# EAGLE schematic 519_jetson_nano_2GB020000 (EAGLE 9.6.2)

## Sheet 1 of 2
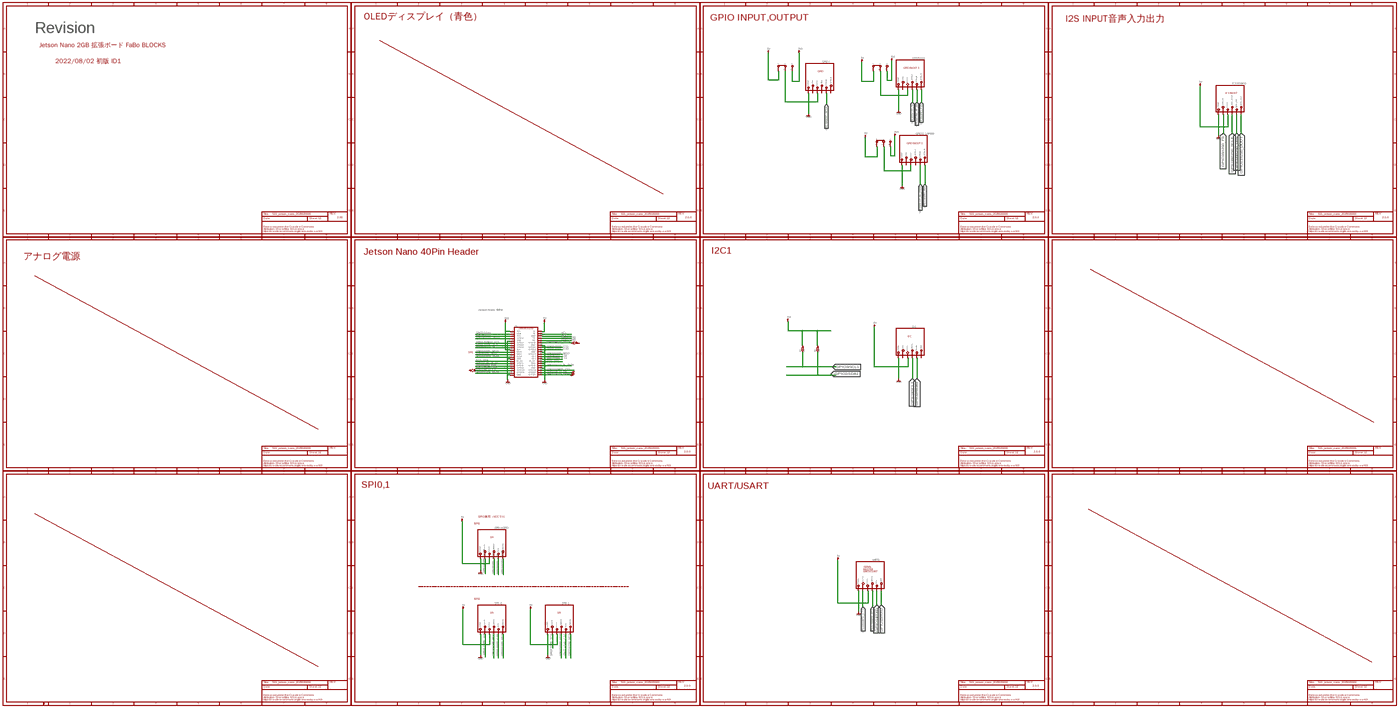
[diagram p0: schematic, sheet 1, overview]
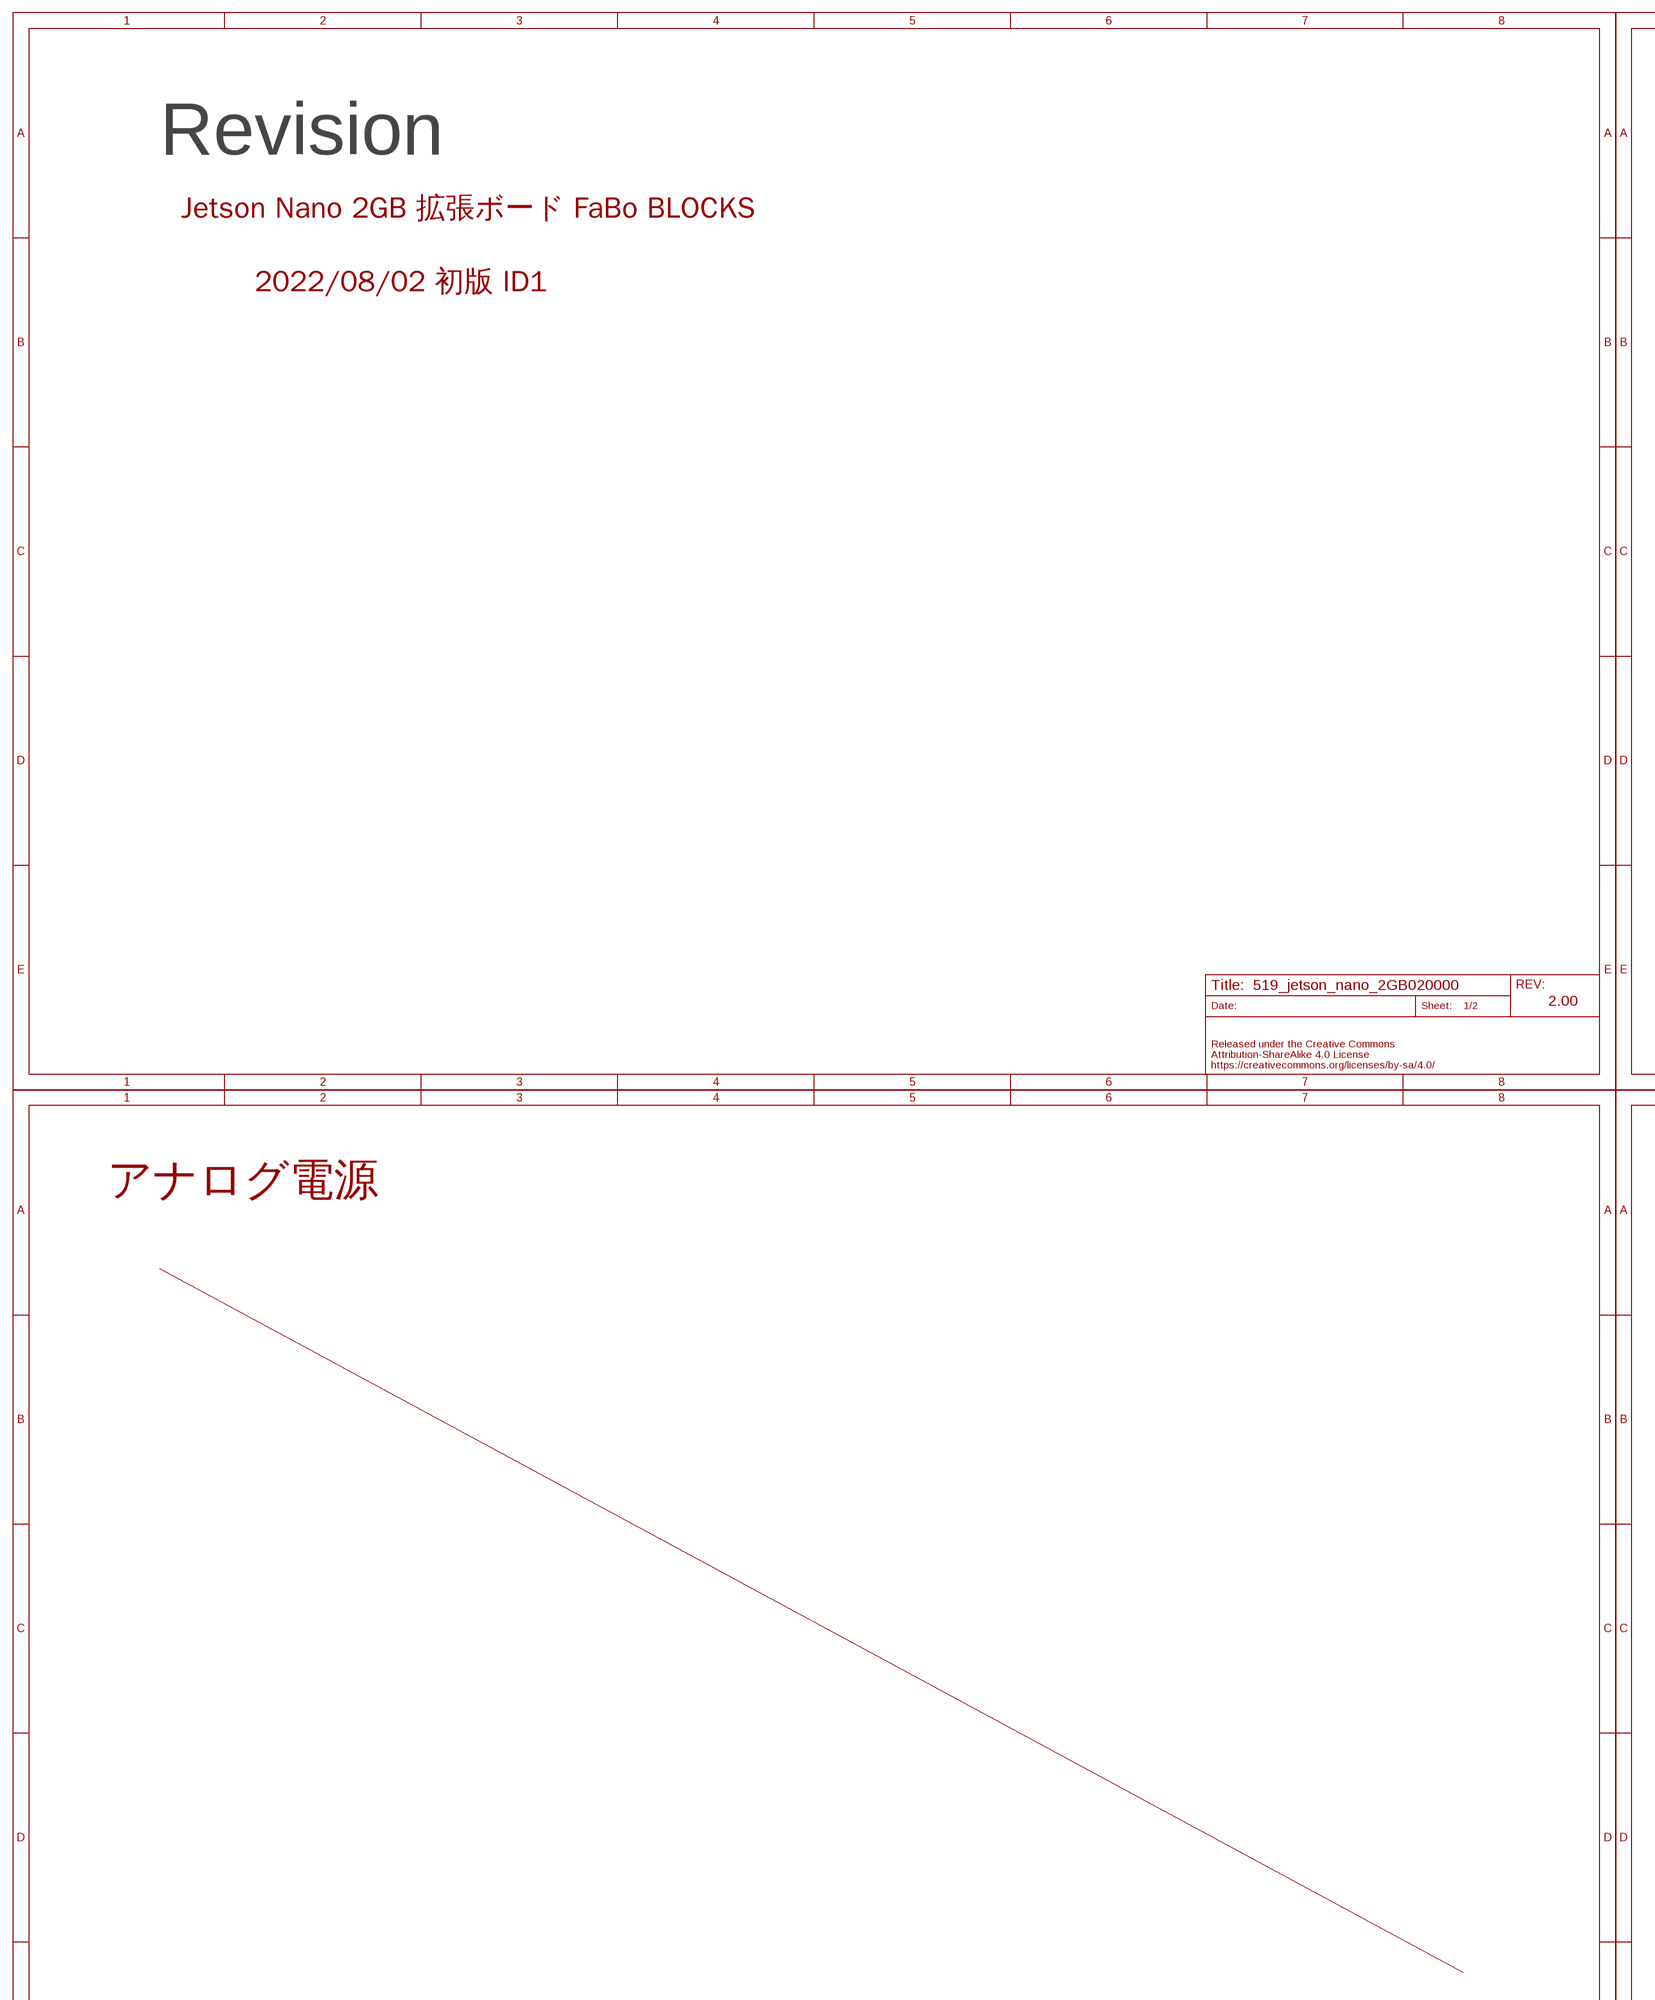
[diagram p1: schematic, sheet 1, part 1 of 6]
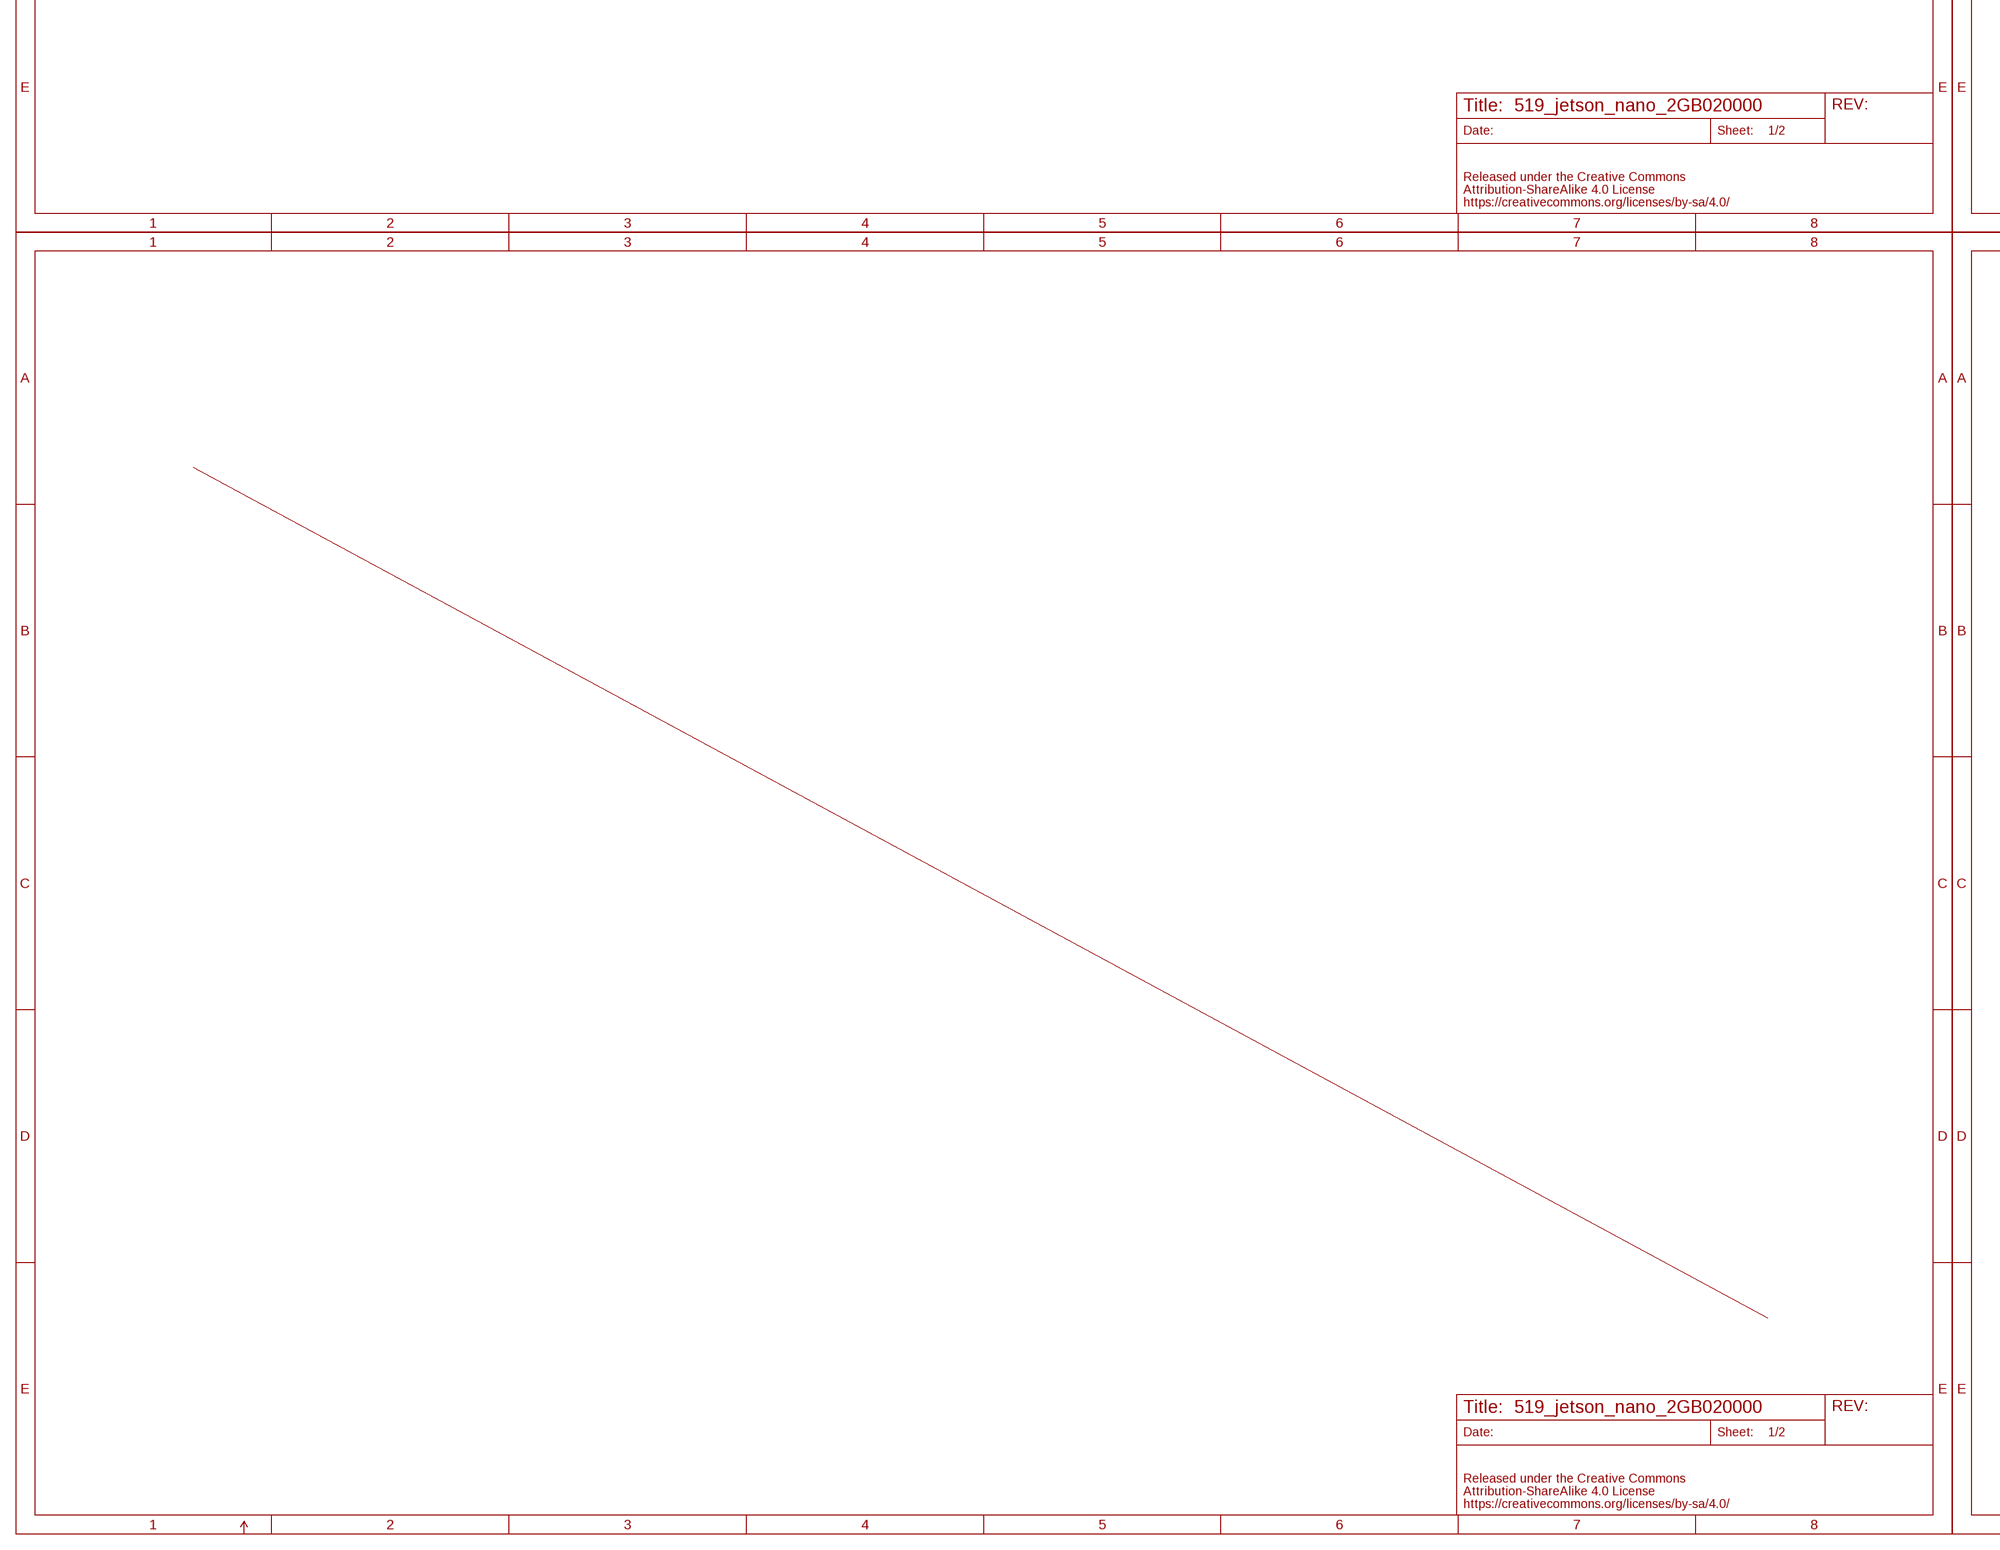
[diagram p2: schematic, sheet 1, part 2 of 6]
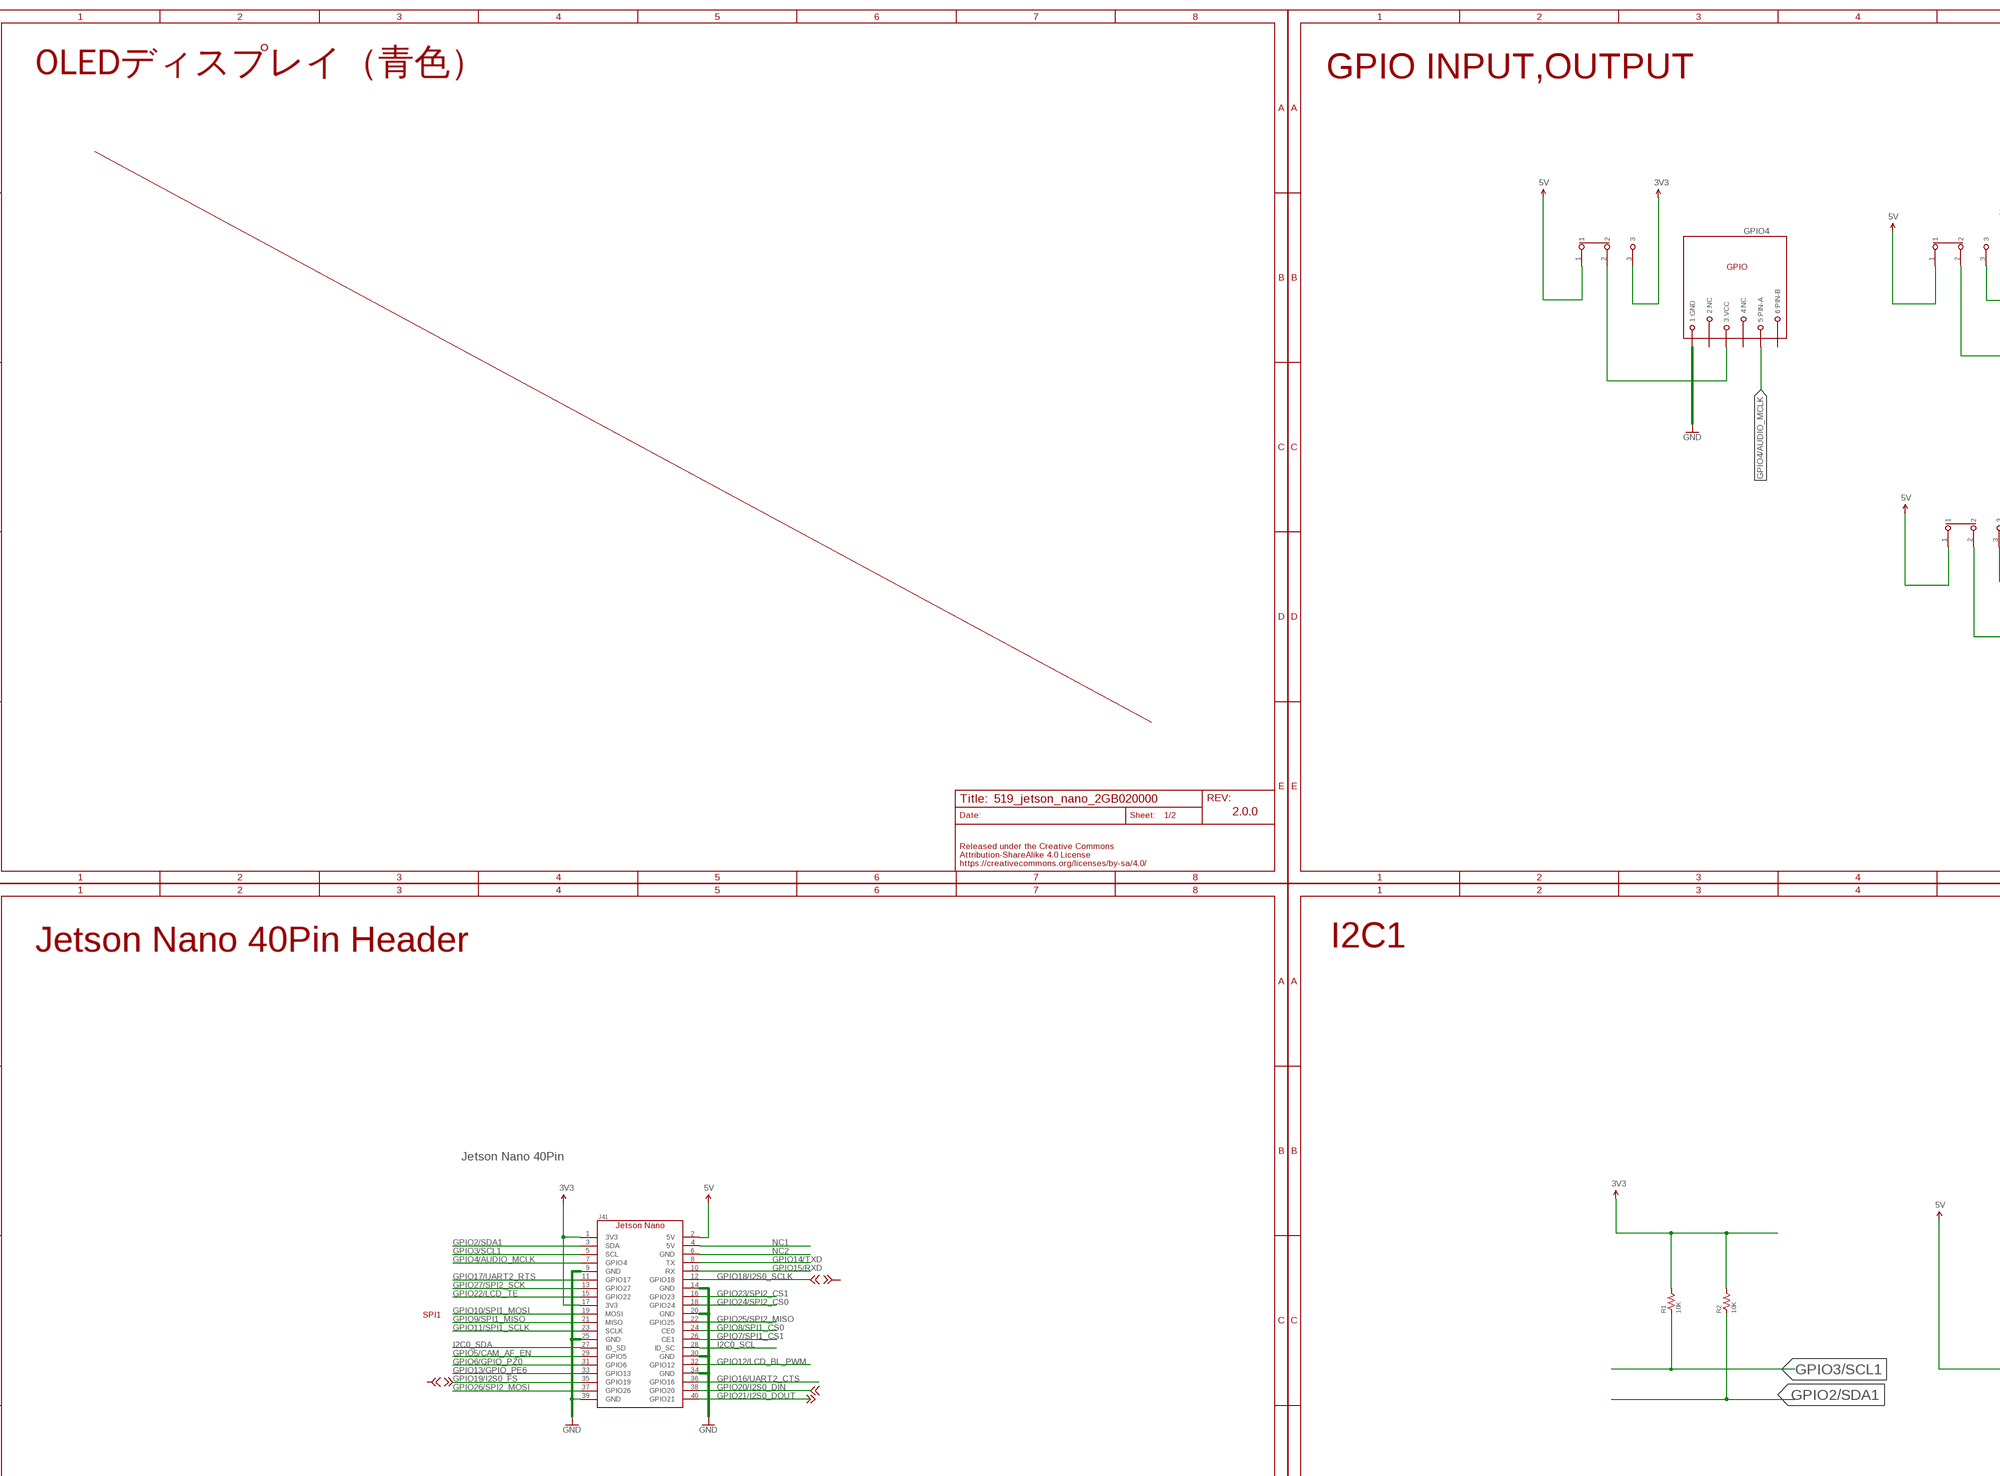
[diagram p3: schematic, sheet 1, part 3 of 6]
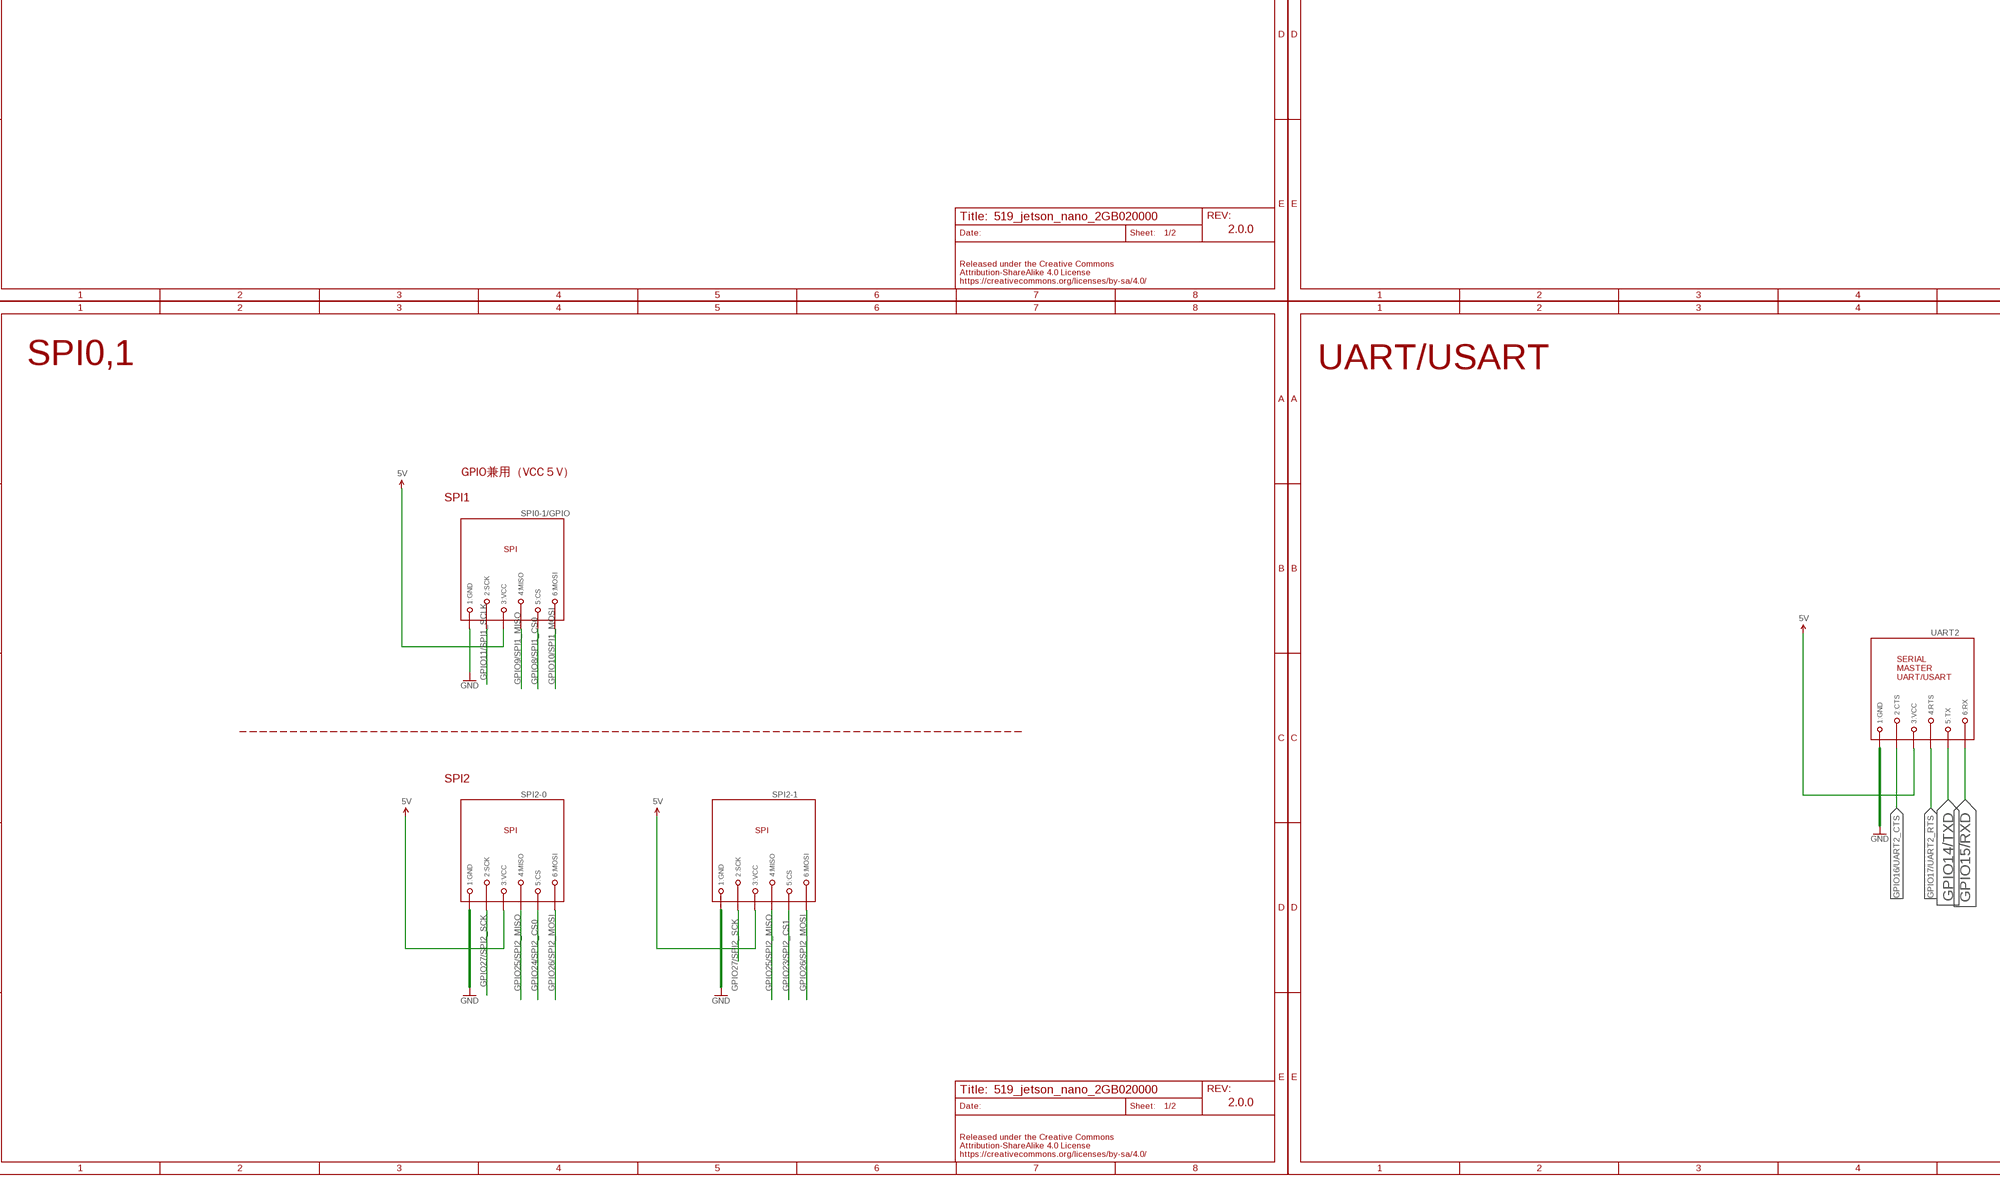
[diagram p4: schematic, sheet 1, part 4 of 6]
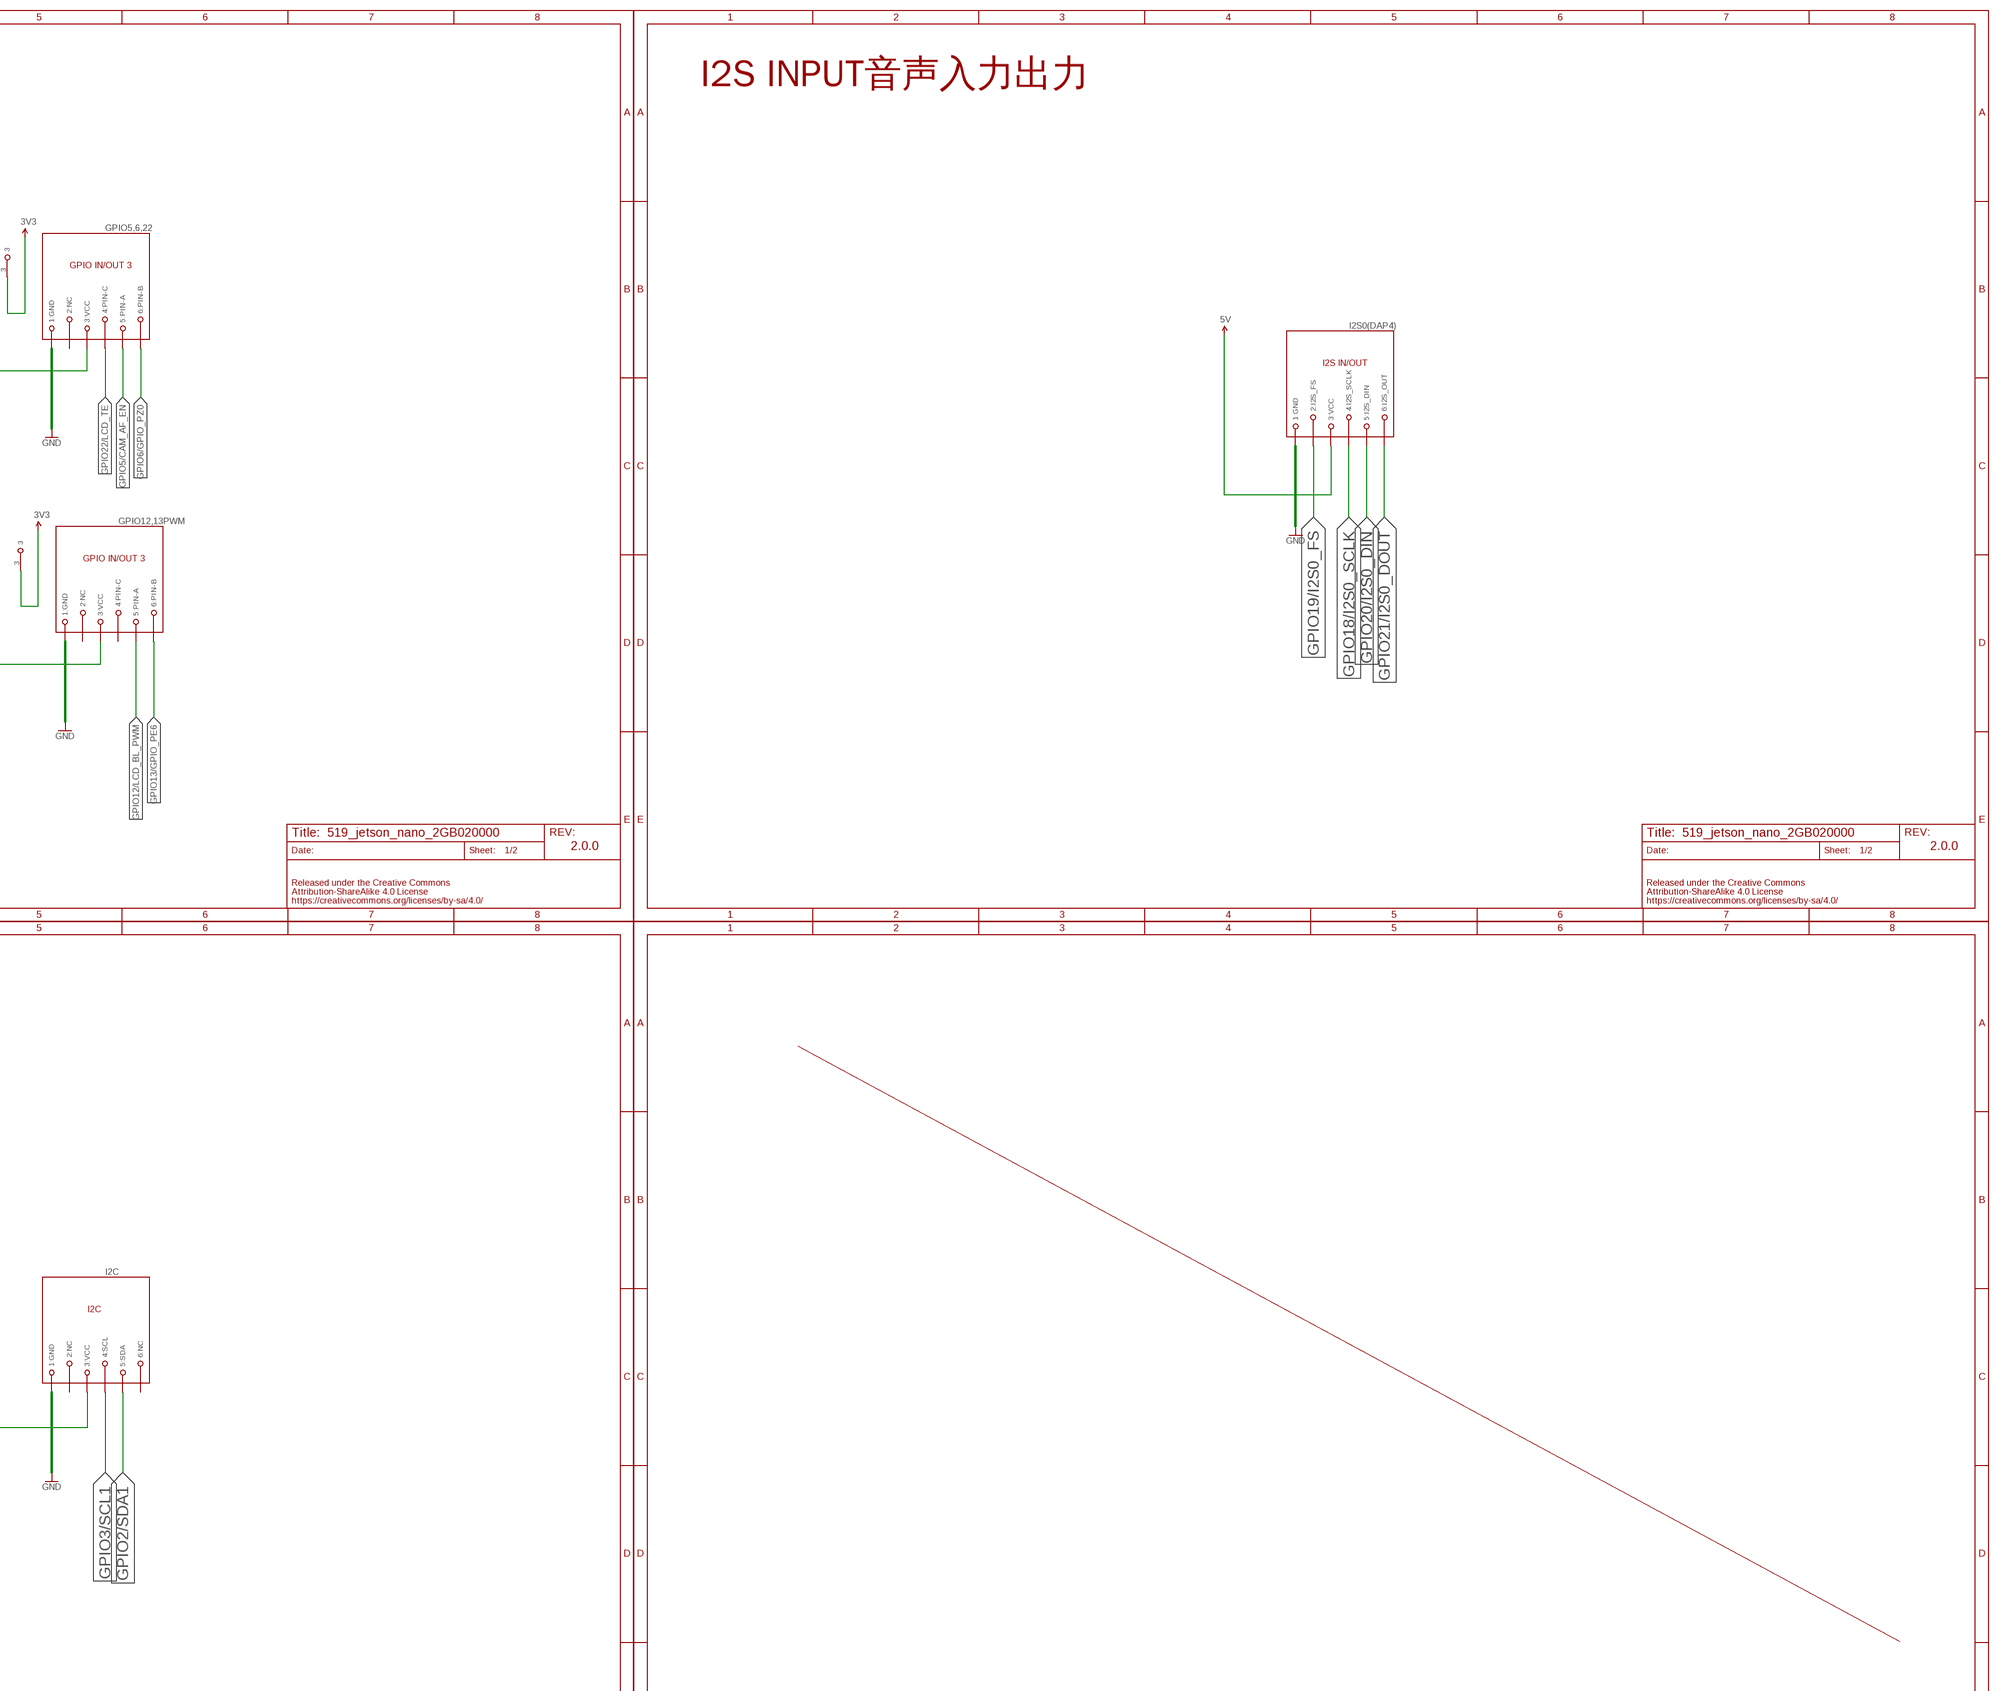
[diagram p5: schematic, sheet 1, part 5 of 6]
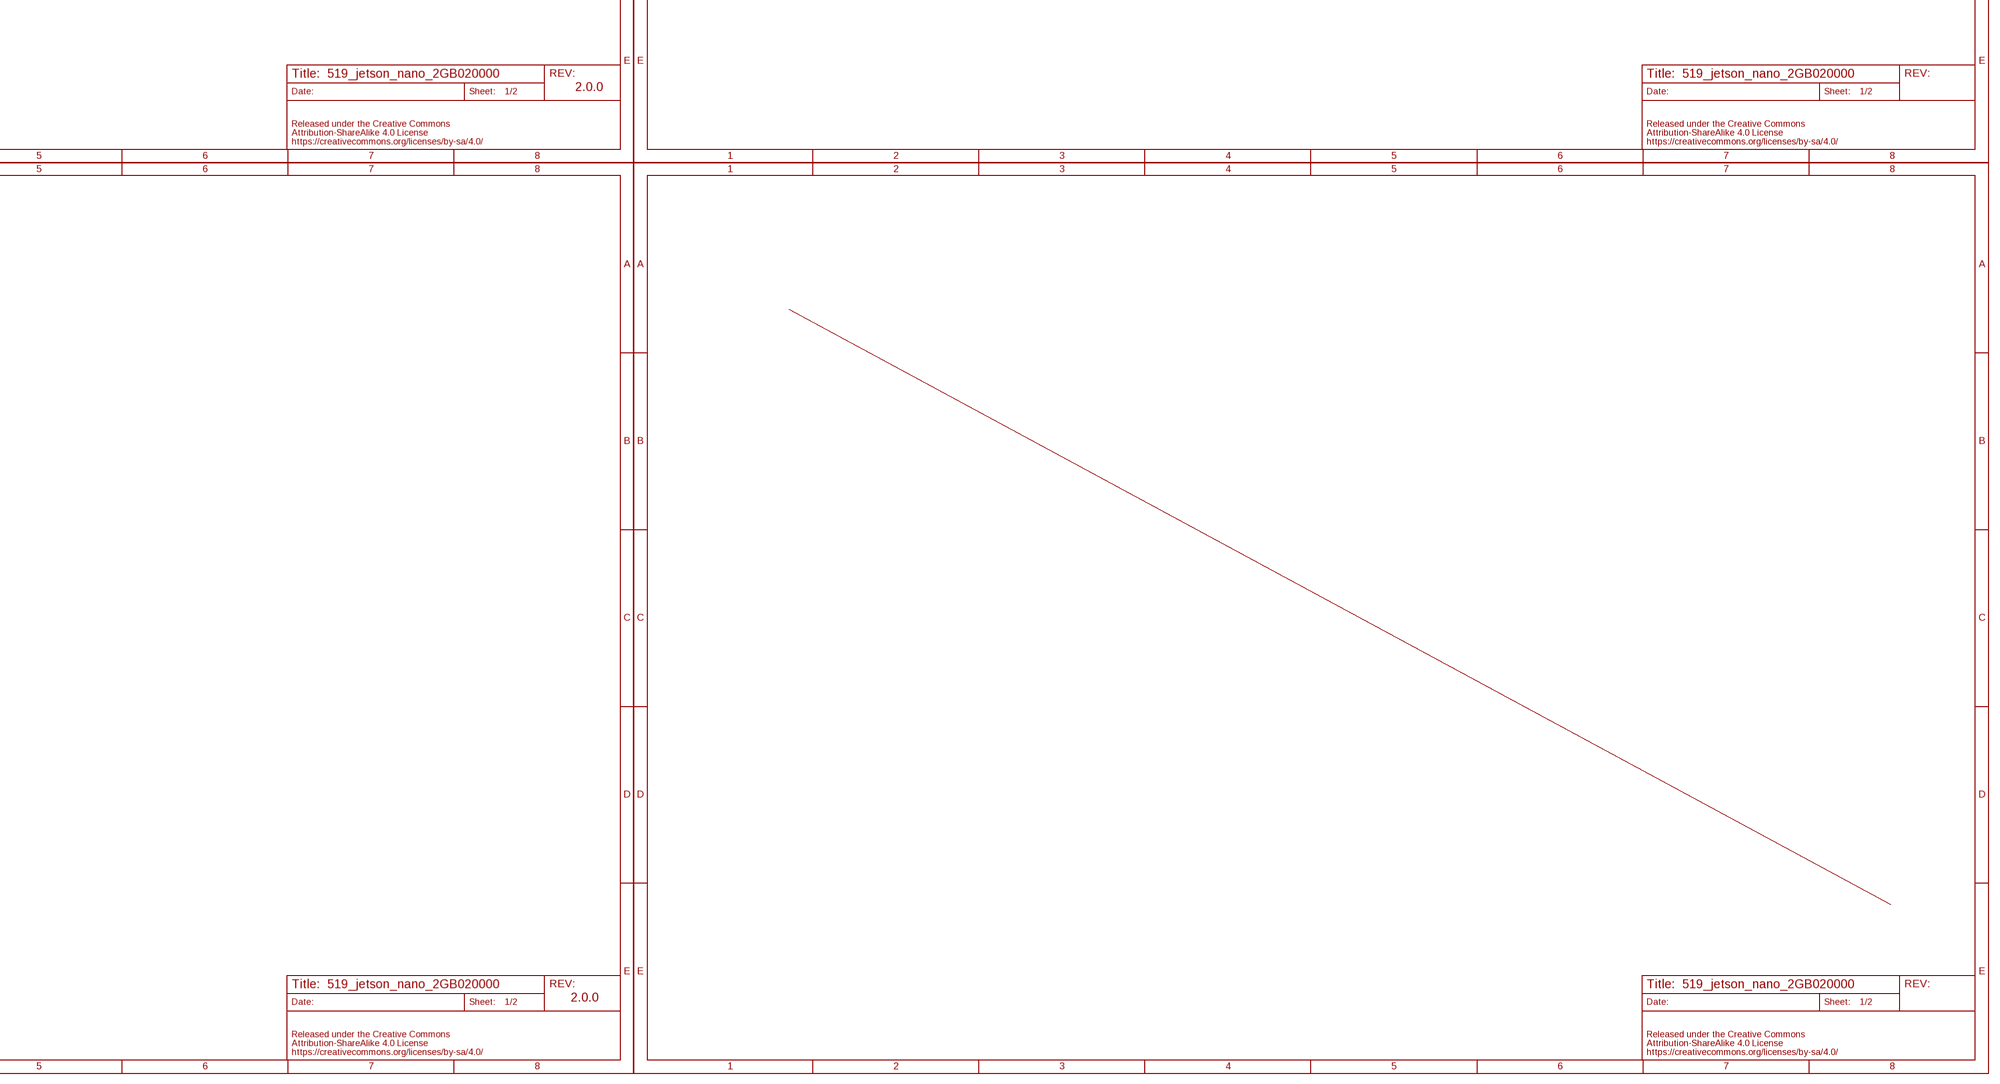
[diagram p6: schematic, sheet 1, part 6 of 6]

### Parts
GPIO4  MODULAR-JACK-6P-RJ11_GPIO  [7002-6PXC-X]
GPIO5,6,22  MODULAR-JACK-6P-RJ11_GPIO3  [7002-6PXC-X]
GPIO12,13PWM  MODULAR-JACK-6P-RJ11_GPIO3  [7002-6PXC-X]
I2C  MODULAR-JACK-6P-RJ11_I2C  [7002-6PXC-X]
I2S0(DAP4)  MODULAR-JACK-6P-RJ11_I2S_MASTER  [7002-6PXC-X]
J41  JETSON_NANOJETSON_NANO_OVERALL  [JETSON_NANO_DEMENTION]
R1  10K  RESISTOR-0402  [0402]
R2  10K  RESISTOR-0402  [0402]
SPI0-1/GPIO  MODULAR-JACK-6P-RJ11_SPI  [7002-6PXC-X]
SPI2-0  MODULAR-JACK-6P-RJ11_SPI  [7002-6PXC-X]
SPI2-1  MODULAR-JACK-6P-RJ11_SPI  [7002-6PXC-X]
U$3  SSSS213202  [SSSS213202]
U$4  SSSS213202  [SSSS213202]
U$32  SSSS213202  [SSSS213202]
UART2  MODULAR-JACK-6P-RJ11_SERIAL_M_USART  [7002-6PXC-X]

### Nets
3V3: J41.1(3V3) J41.17(3V3) R1.2 R2.2 U$3.3 U$4.3 U$32.3
5V: I2C.3(3:VCC) I2S0(DAP4).3(3:VCC) J41.2(5V) SPI0-1/GPIO.3(3:VCC) SPI2-0.3(3:VCC) SPI2-1.3(3:VCC) U$3.1 U$4.1 U$32.1 UART2.3(3:VCC)
GND: GPIO4.1(1:GND) GPIO5,6,22.1(1:GND) GPIO12,13PWM.1(1:GND) I2C.1(1:GND) I2S0(DAP4).1(1:GND) J41.9(GND) J41.14(GND) J41.20(GND) J41.25(GND) J41.30(GND) J41.34(GND) J41.39(GND) SPI0-1/GPIO.1(1:GND) SPI2-0.1(1:GND) SPI2-1.1(1:GND) UART2.1(1:GND)
GPIO2/SDA1: I2C.5(5:SDA) J41.3(SDA) R2.1
GPIO3/SCL1: I2C.4(4:SCL) J41.5(SCL) R1.1
GPIO4/AUDIO_MCLK: GPIO4.5(5:PIN-A) J41.7(GPIO4)
GPIO5/CAM_AF_EN: GPIO5,6,22.5(5:PIN-A) J41.29(GPIO5)
GPIO6/GPIO_PZ0: GPIO5,6,22.6(6:PIN-B) J41.31(GPIO6)
GPIO7/SPI1_CS1: J41.26(CE1)
GPIO8/SPI1_CS0: J41.24(CE0) SPI0-1/GPIO.5(5:CS)
GPIO9/SPI1_MISO: J41.21(MISO) SPI0-1/GPIO.4(4:MISO)
GPIO10/SPI1_MOSI: J41.19(MOSI) SPI0-1/GPIO.6(6:MOSI)
GPIO11/SPI1_SCLK: J41.23(SCLK) SPI0-1/GPIO.2(2:SCK)
GPIO12/LCD_BL_PWM: GPIO12,13PWM.5(5:PIN-A) J41.32(GPIO12)
GPIO13/GPIO_PE6: GPIO12,13PWM.6(6:PIN-B) J41.33(GPIO13)
GPIO14/TXD: J41.8(TX) UART2.5(5:TX)
GPIO15/RXD: J41.10(RX) UART2.6(6:RX)
GPIO16/UART2_CTS: J41.36(GPIO16) UART2.2(2:CTS)
GPIO17/UART2_RTS: J41.11(GPIO17) UART2.4(4:RTS)
GPIO18/I2S0_SCLK: I2S0(DAP4).4(4:I2S_SCLK) J41.12(GPIO18)
GPIO19/I2S0_FS: I2S0(DAP4).2(2:I2S_FS) J41.35(GPIO19)
GPIO20/I2S0_DIN: I2S0(DAP4).5(5:I2S_DIN) J41.38(GPIO20)
GPIO21/I2S0_DOUT: I2S0(DAP4).6(6:I2S_OUT) J41.40(GPIO21)
GPIO22/LCD_TE: GPIO5,6,22.4(4:PIN-C) J41.15(GPIO22)
GPIO23/SPI2_CS1: J41.16(GPIO23) SPI2-1.5(5:CS)
GPIO24/SPI2_CS0: J41.18(GPIO24) SPI2-0.5(5:CS)
GPIO25/SPI2_MISO: J41.22(GPIO25) SPI2-0.4(4:MISO) SPI2-1.4(4:MISO)
GPIO26/SPI2_MOSI: J41.37(GPIO26) SPI2-0.6(6:MOSI) SPI2-1.6(6:MOSI)
GPIO27/SPI2_SCK: J41.13(GPIO27) SPI2-0.2(2:SCK) SPI2-1.2(2:SCK)
I2C0_SCL: J41.28(ID_SC)
I2C0_SDA: J41.27(ID_SD)
N$1: GPIO5,6,22.3(3:VCC) U$3.2
N$2: GPIO12,13PWM.3(3:VCC) U$4.2
N$15: GPIO4.3(3:VCC) U$32.2
NC1: J41.4(5V)
NC2: J41.6(GND)
Unconnected: GPIO4.2(2:NC) GPIO4.4(4:NC) GPIO4.6(6:PIN-B) GPIO5,6,22.2(2:NC) GPIO12,13PWM.2(2:NC) GPIO12,13PWM.4(4:PIN-C) I2C.2(2:NC) I2C.6(6:NC)

### Notes on the sheet
- OLEDディスプレイ（青色） | GPIO INPUT,OUTPUT | I2S INPUT音声入力出力
- Revision
- Jetson Nano 2GB 拡張ボード FaBo BLOCKS
- 2022/08/02 初版 ID1
- 2.00 | 2.0.0 | 2.0.0 | 2.0.0
- Jetson Nano 40Pin Header | I2C1
- アナログ電源
- Jetson Nano 40Pin
- SPI1
- 2.0.0 | 2.0.0
- SPI0,1 | UART/USART
- GPIO兼用（VCC５V）
- SPI1
- SPI2
- 2.0.0 | 2.0.0

## Sheet 2 of 2
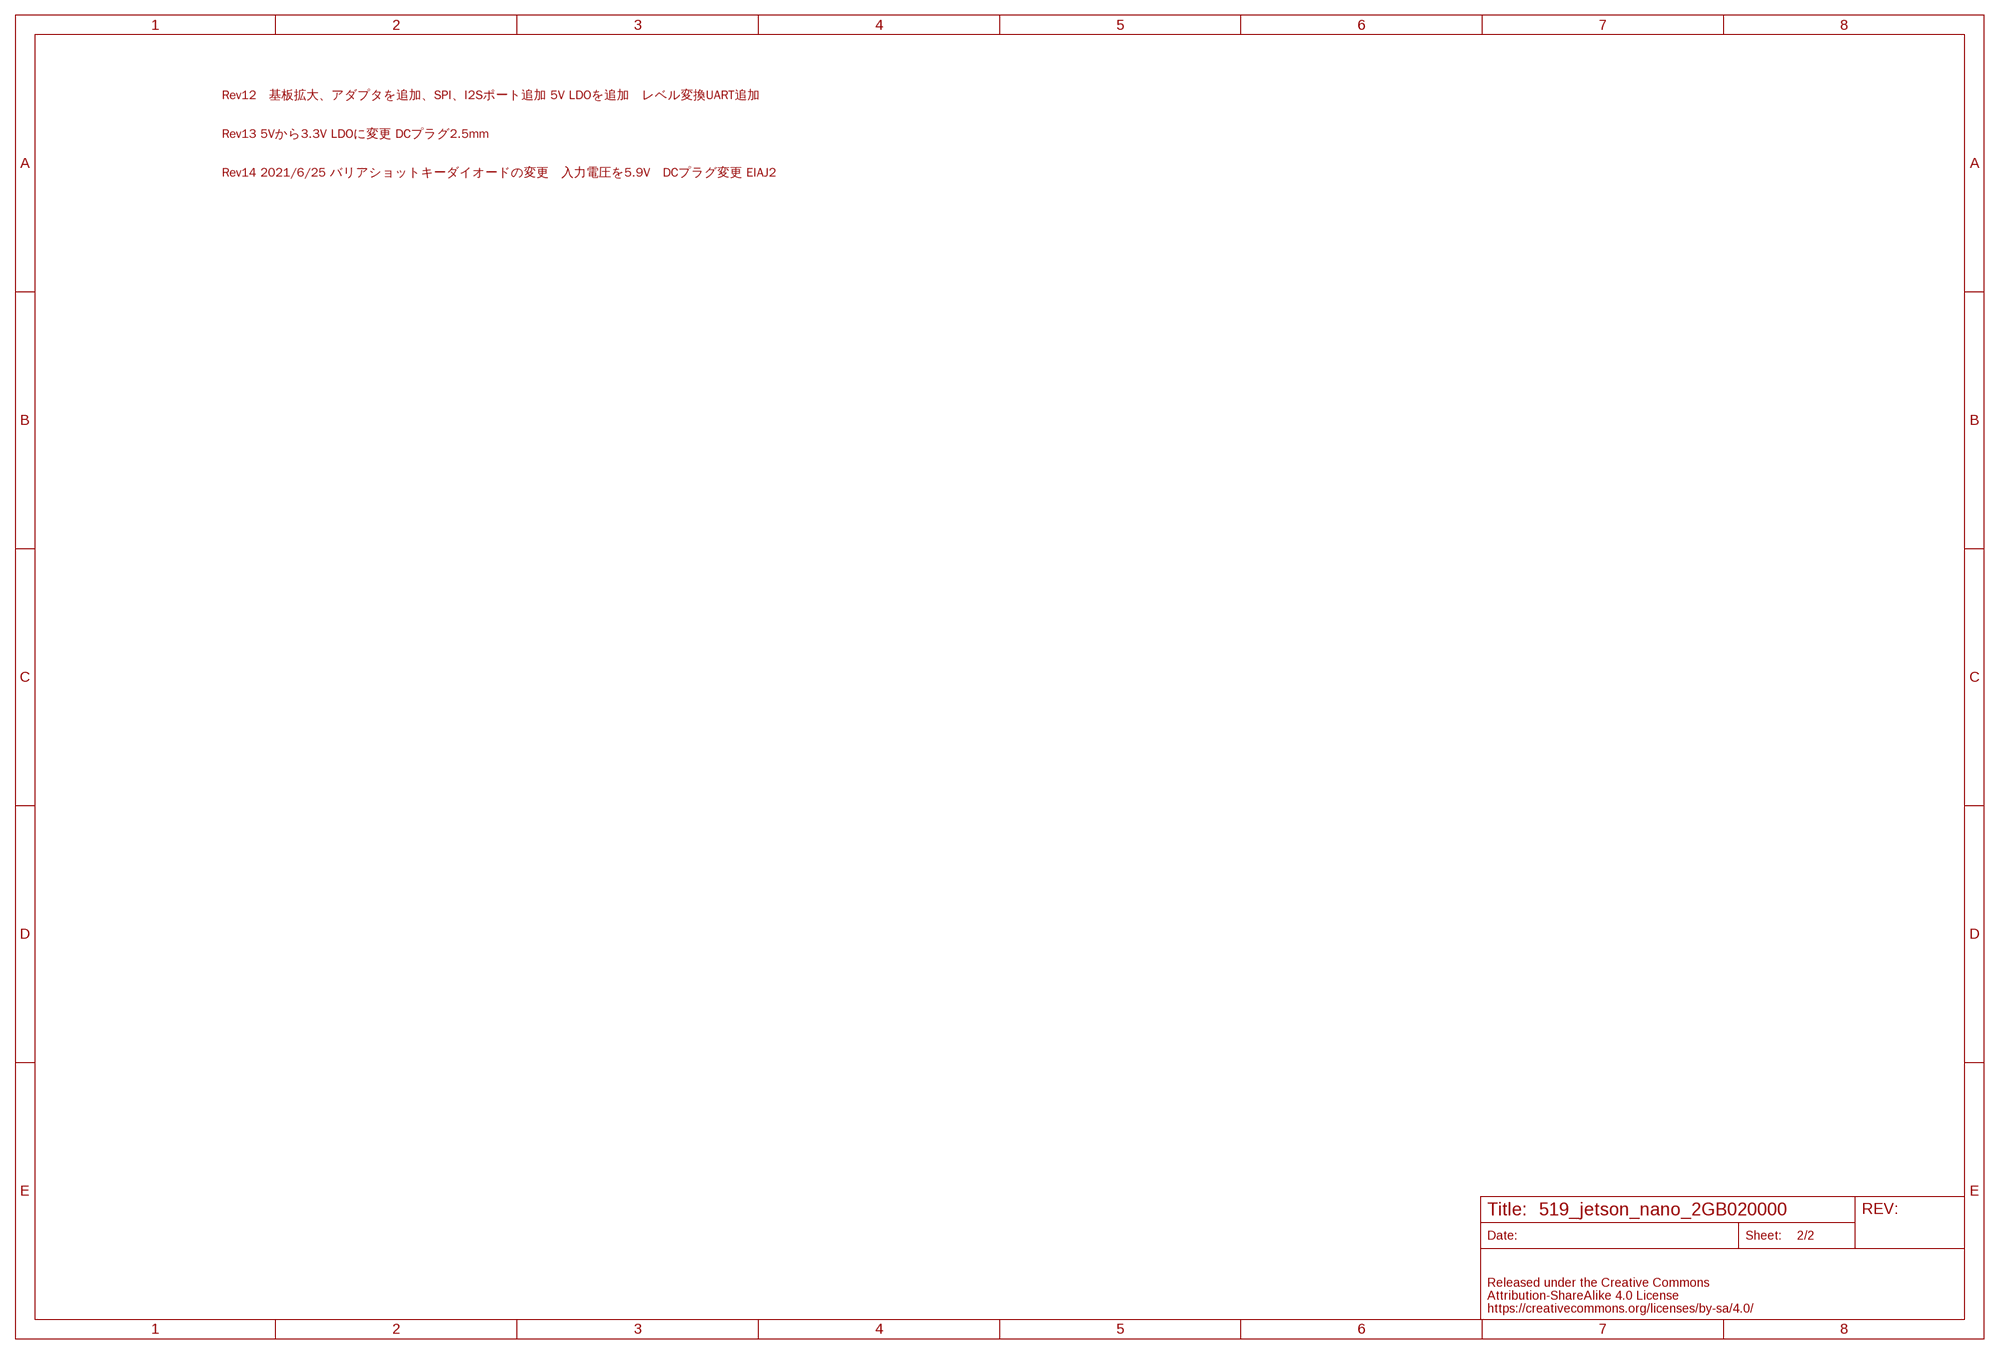
[diagram p7: schematic, sheet 2]

### Notes on the sheet
- Rev12　基板拡大、アダプタを追加、SPI、I2Sポート追加 5V LDOを追加　レベル変換UART追加
- Rev13 5Vから3.3V LDOに変更 DCプラグ2.5mm
- Rev14 2021/6/25 バリアショットキーダイオードの変更　入力電圧を5.9V　DCプラグ変更 EIAJ2

## Library data of the parts
GPIO4 = FaBo-Connetor:MODULAR-JACK-6P-RJ11_GPIO
GPIO5,6,22 GPIO12,13PWM = FaBo-Connetor:MODULAR-JACK-6P-RJ11_GPIO3
I2C = FaBo-Connetor:MODULAR-JACK-6P-RJ11_I2C
I2S0(DAP4) = FaBo-Connetor:MODULAR-JACK-6P-RJ11_I2S_MASTER
J41 = FaBo-Boards:JETSON_NANO
R1 R2 = FaBo-Resistors:RESISTOR: RESISTOR
SPI0-1/GPIO SPI2-0 SPI2-1 = FaBo-Connetor:MODULAR-JACK-6P-RJ11_SPI
U$3 U$4 U$32 = FaBo-Switch:SSSS213202
UART2 = FaBo-Connetor:MODULAR-JACK-6P-RJ11_SERIAL_M_USART